# Altium schematic sheet TU_PWR.SchDoc
size A0
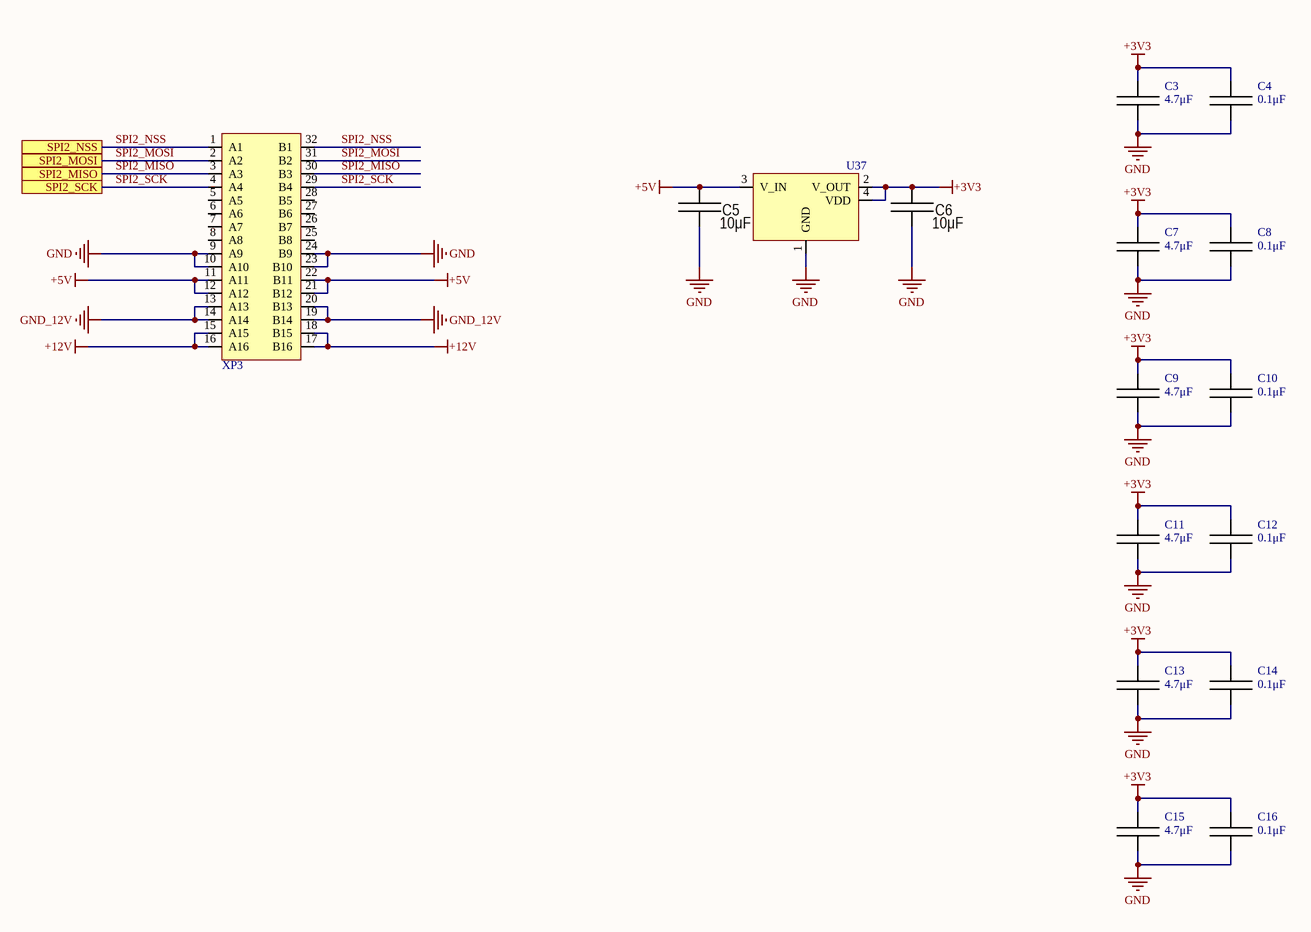
[diagram p0: TU_PWR.SchDoc]

## Parts
C3  value 4.7μF  [CAP: 0603]  (hidden comment: Cap_0603)
C4  value 0.1μF  [CAP: 0603]  (hidden comment: Cap_0603)
C5  value 10μF  [CAP: 1210]
C6  value 10μF  [CAP: 1210]
C7  value 4.7μF  [CAP: 0603]  (hidden comment: Cap_0603)
C8  value 0.1μF  [CAP: 0603]  (hidden comment: Cap_0603)
C9  value 4.7μF  [CAP: 0603]  (hidden comment: Cap_0603)
C10  value 0.1μF  [CAP: 0603]  (hidden comment: Cap_0603)
C11  value 4.7μF  [CAP: 0603]  (hidden comment: Cap_0603)
C12  value 0.1μF  [CAP: 0603]  (hidden comment: Cap_0603)
C13  value 4.7μF  [CAP: 0603]  (hidden comment: Cap_0603)
C14  value 0.1μF  [CAP: 0603]  (hidden comment: Cap_0603)
C15  value 4.7μF  [CAP: 0603]  (hidden comment: Cap_0603)
C16  value 0.1μF  [CAP: 0603]  (hidden comment: Cap_0603)
U37  LD1117S33CTR4  [SOT-223-3]  (value not drawn)
XP3  DS1118-32M-R23  [DS1118-32M-R23]  (value not drawn)

## Ports
SPI2_MISO, SPI2_MOSI, SPI2_NSS, SPI2_SCK

## Nets
+3V3: C3.2 C4.2 C6.2 C7.2 C8.2 C9.2 C10.2 C11.2 C12.2 C13.2 C14.2 C15.2 C16.2 U37.2(V_OUT) U37.4(VDD)
+5V: C5.2 U37.3(V_IN) XP3.11(A11) XP3.12(A12) XP3.21(B12) XP3.22(B11)
+12V: XP3.15(A15) XP3.16(A16) XP3.17(B16) XP3.18(B15)
GND: C3.1 C4.1 C5.1 C6.1 C7.1 C8.1 C9.1 C10.1 C11.1 C12.1 C13.1 C14.1 C15.1 C16.1 U37.1(GND) XP3.9(A9) XP3.10(A10) XP3.23(B10) XP3.24(B9)
GND_12V: XP3.13(A13) XP3.14(A14) XP3.19(B14) XP3.20(B13)
SPI2_MISO: XP3.3(A3) XP3.30(B3) ; port SPI2_MISO
SPI2_MOSI: XP3.2(A2) XP3.31(B2) ; port SPI2_MOSI
SPI2_NSS: XP3.1(A1) XP3.32(B1) ; port SPI2_NSS
SPI2_SCK: XP3.4(A4) XP3.29(B4) ; port SPI2_SCK

Not connected (* = marked no-connect by the designer): XP3 5(A5) 6(A6) 7(A7) 8(A8) 25(B8) 26(B7) 27(B6) 28(B5)

## Library data of the parts
C3 C7 C9 C11 C13 C15 = Cap_0603: TypeDielectric: X7R(X5R); Voltage: 25V; Package/Case: 0603; Temperature: -55...+125°C(-55...+85°C); Product Category: Capacitors
C4 C8 C10 C12 C14 C16 = Cap_0603: TypeDielectric: X7R(X5R); Voltage: 16V; Package/Case: 0603; Temperature: -55...+125°C(-55...+85°C); Product Category: Capacitors
C5 C6 = Ceramic_1210: Manufacturer: Yageo; PartNumber: CC1210KKX7R9BB104; TypeCapacitor: Ceramic capacitor; Tolerance: ±10%; TypeDielectric: X7R; Package: 1210; HelpURL: https://www.digikey.com/product-detail/en/yageo/CC1210KKX7R9BB104/311-4522-1-ND/8025611; ValueManufacturerPartNumber: =TypeCapacitor+', '+Value+', '+TypeDielectric+', '+Tolerance+', '+Voltage+', '+Package+', '+Temperature; Temperature: -55...+125°C
U37 = LD1117S33CTR: LDO Voltage Regulator 3.3V 0.8A Positive; Manufacturer: STMicroelectronics; Datasheet: https://eu.mouser.com/datasheet/2/389/cd00000544-1795431.pdf; HelpURL: https://eu.mouser.com/ProductDetail/STMicroelectronics/LD1117S33CTR?qs=8u%2FLf1IQwKF9meFZLHfRog%3D%3D; Package/Case: SOT-223-3; Product Category: Voltage Regulators
XP3 = DS1118-32M-R23: DIN 41612 Connector; Manufacturer: Connfly; Analogue: HARTING 09221326951(https://eu.mouser.com/ProductDetail/HARTING/09221326951?qs=Afqhj6cPmO9f0oVZo6yWiA%3D%3D); Datasheet: http://en.connfly.group/static/upload/file/pdf/DS1118.pdf; HelpURL: https://www.chipdip.by/product/din41612r-ds1118-32m-r23; Product Category: Connectors